# EAGLE design Main_board_rev21_top_image (EAGLE 9.1.1)

## Sheet 1 of 2
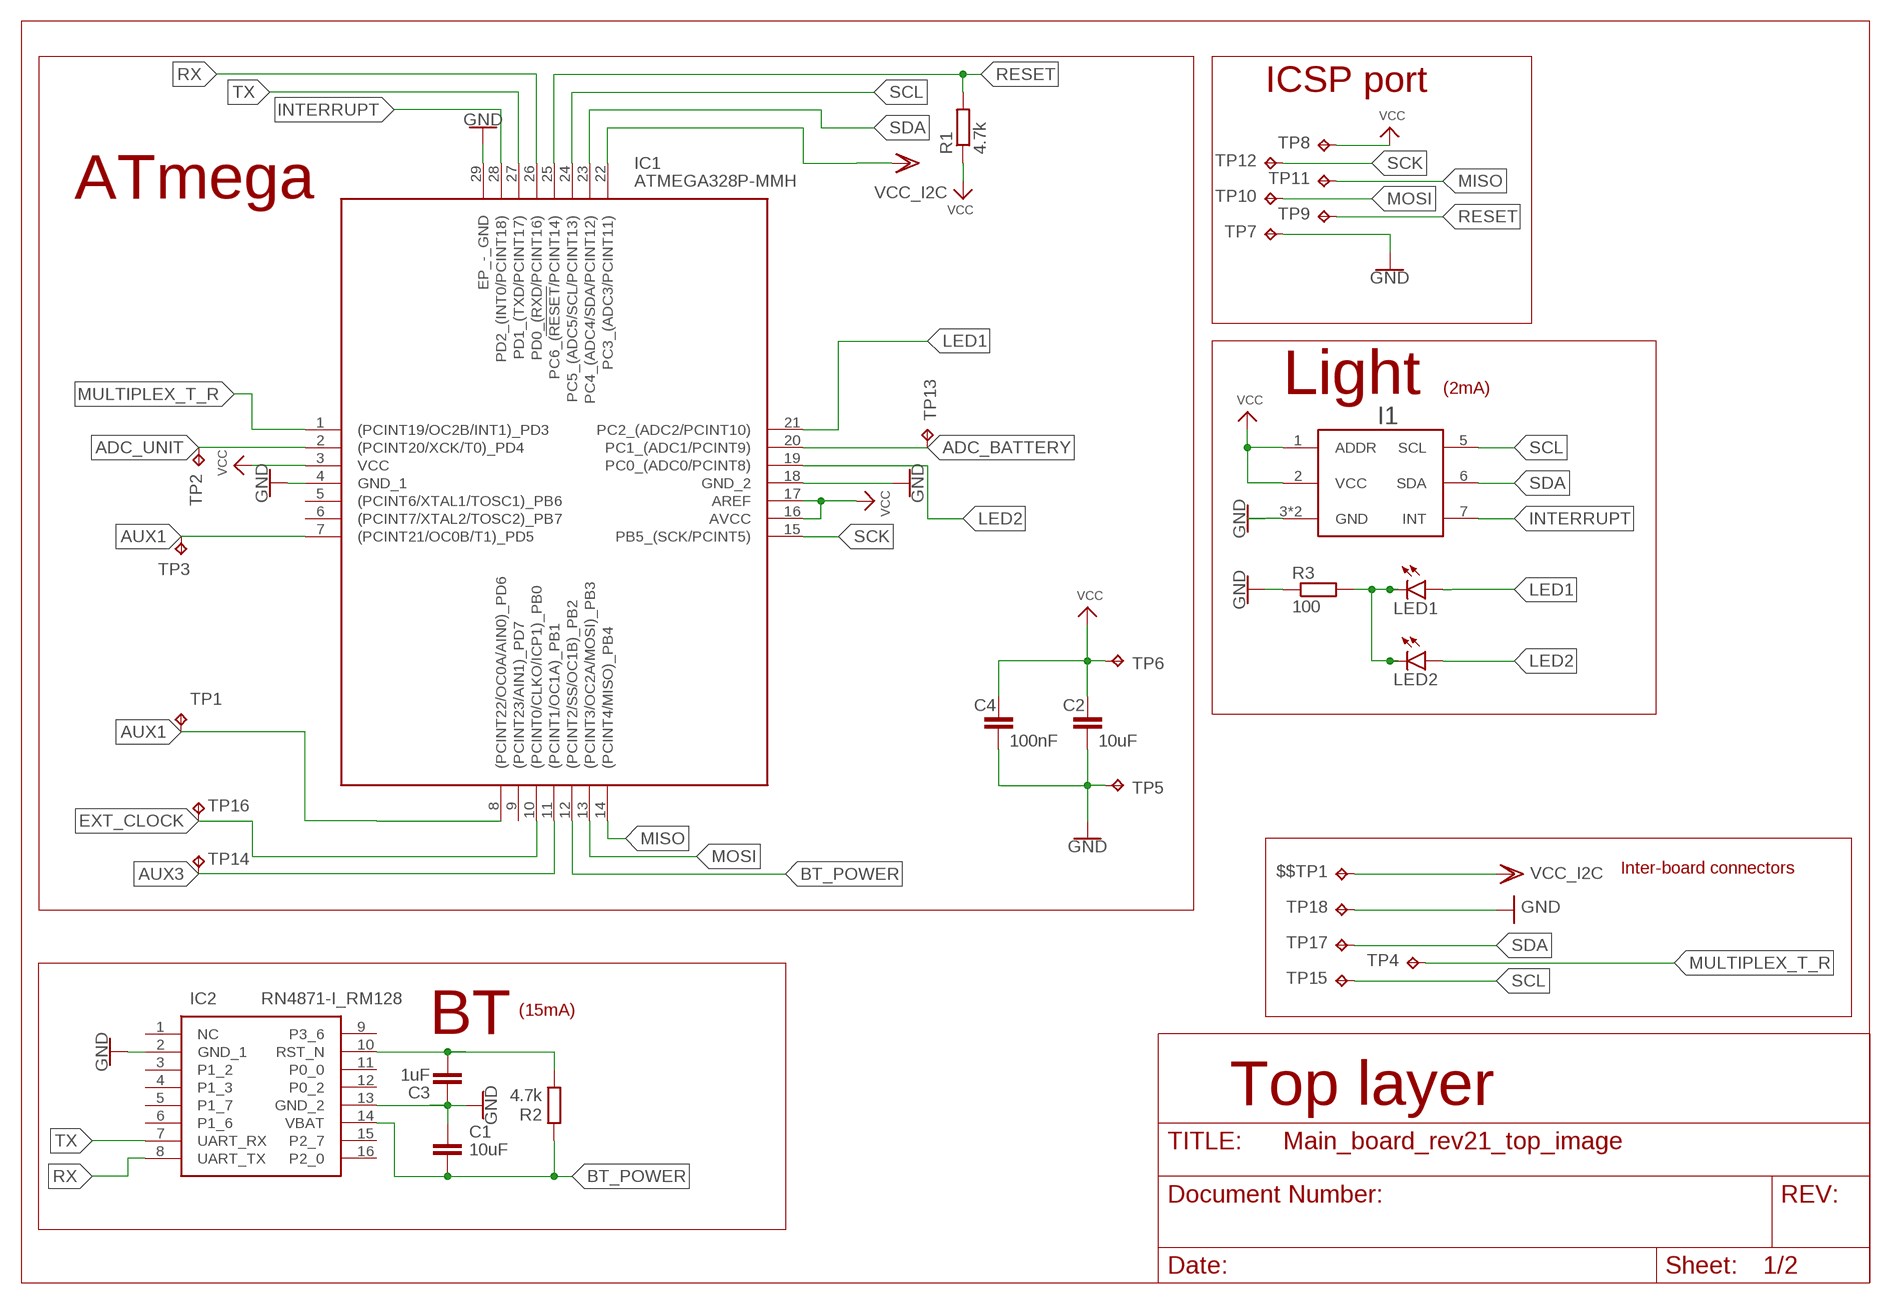
[diagram p0: schematic, sheet 1]

### Parts
$$TP1  TP  [TEST_PAD_1MM]
C1  10uF  C-EUC0603K  [C0603K]
C2  10uF  C-EUC0603K  [C0603K]
C3  1uF  C-EUC0603K  [C0603K]
C4  100nF  C-EUC0603K  [C0603K]
I1  BH1745NUC  [WSON008X2120]
IC1  ATMEGA328P-MMH  [QFN45P400X400X100-29N]
IC2  RN4871-I_RM128  [RN4871]
LED1  LEDCHIPLED_0603  [CHIPLED_0603]
LED2  LEDCHIPLED_0603  [CHIPLED_0603]
R1  4.7k  R-EU_R0603  [R0603]
R2  4.7k  R-EU_R0603  [R0603]
R3  100  R-EU_R0603  [R0603]
TP1  TP  [TEST_PAD_1MM]
TP2  TP  [TEST_PAD_1MM]
TP3  TP  [TEST_PAD_1MM]
TP4  TP  [TEST_PAD_1MM]
TP5  TP  [TEST_PAD_1MM]
TP6  TP  [TEST_PAD_1MM]
TP7  TPTP09SQ  [TP09SQ]
TP8  TPTP09SQ  [TP09SQ]
TP9  TPTP09SQ  [TP09SQ]
TP10  TPTP09SQ  [TP09SQ]
TP11  TPTP09SQ  [TP09SQ]
TP12  TPTP09SQ  [TP09SQ]
TP13  TP  [TEST_PAD_1MM]
TP14  TP  [TEST_PAD_1MM]
TP15  TP  [TEST_PAD_1MM]
TP16  TP  [TEST_PAD_1MM]
TP17  TP  [TEST_PAD_1MM]
TP18  TP  [TEST_PAD_1MM]

### Nets
ADC_BATTERY: IC1.20(PC1_(ADC1/PCINT9)) TP13.P$1(TP)
ADC_UNIT: IC1.2((PCINT20/XCK/T0)_PD4) TP2.P$1(TP)
AUX1: IC1.7((PCINT21/OC0B/T1)_PD5) TP3.P$1(TP)
AUX3: IC1.11((PCINT1/OC1A)_PB1) TP14.P$1(TP)
BT_POWER: C1.1 IC1.12((PCINT2/SS/OC1B)_PB2) IC2.14(VBAT) R2.2
BT_RESET: C3.2 IC2.10(RST_N) R2.1
EXT_CLOCK: IC1.10((PCINT0/CLKO/ICP1)_PB0) TP16.P$1(TP)
GND: C1.2 C2.2 C3.1 C4.2 I1.3(GND) I1.4(GND) IC1.4(GND_1) IC1.18(GND_2) IC1.29(EP_-_GND) IC2.2(GND_1) IC2.13(GND_2) R3.1 TP5.P$1(TP) TP7.TP TP18.P$1(TP)
INTERRUPT: I1.7(INT) IC1.28(PD2_(INT0/PCINT18))
LED1: IC1.21(PC2_(ADC2/PCINT10)) LED1.A
LED2: IC1.19(PC0_(ADC0/PCINT8)) LED2.A
MISO: IC1.14((PCINT4/MISO)_PB4) TP11.TP
MOSI: IC1.13((PCINT3/OC2A/MOSI)_PB3) TP10.TP
MULTIPLEX_T_R: IC1.1((PCINT19/OC2B/INT1)_PD3) TP4.P$1(TP)
N$1: IC1.8((PCINT22/OC0A/AIN0)_PD6) TP1.P$1(TP)
N$3: LED1.C LED2.C R3.2
RESET: IC1.25(PC6_(!RESET!/PCINT14)) R1.2 TP9.TP
RX: IC1.26(PD0_(RXD/PCINT16)) IC2.8(UART_TX)
SCK: IC1.15(PB5_(SCK/PCINT5)) TP12.TP
SCL: I1.5(SCL) IC1.24(PC5_(ADC5/SCL/PCINT13)) TP15.P$1(TP)
SDA: I1.6(SDA) IC1.23(PC4_(ADC4/SDA/PCINT12)) TP17.P$1(TP)
TX: IC1.27(PD1_(TXD/PCINT17)) IC2.7(UART_RX)
VCC: C2.1 C4.1 I1.1(ADDR) I1.2(VCC) IC1.3(VCC) IC1.16(AVCC) IC1.17(AREF) R1.1 TP6.P$1(TP) TP8.TP
VDD: $$TP1.P$1(TP) IC1.22(PC3_(ADC3/PCINT11)) ; supply symbol labelled VCC_I2C
Unconnected: IC1.5((PCINT6/XTAL1/TOSC1)_PB6) IC1.6((PCINT7/XTAL2/TOSC2)_PB7) IC1.9((PCINT23/AIN1)_PD7) IC2.1(NC) IC2.3(P1_2) IC2.4(P1_3) IC2.5(P1_7) IC2.6(P1_6) IC2.9(P3_6) IC2.11(P0_0) IC2.12(P0_2) IC2.15(P2_7) IC2.16(P2_0)

### Notes on the sheet
- ICSP port
- ATmega
- Light | (2mA)
- Inter-board connectors
- (15mA)
- BT
- Top layer

## Sheet 2 of 2

## Library data of the parts
$$TP1 TP1-TP18 = 0_my_lib:TP: Test pad
C1-C4 = resistor:C-EU: CAPACITOR, European symbol
I1 = 0_my_lib:BH1745NUC: A RGBC ambient light sensor
IC1 = SamacSys_Parts:ATMEGA328P-MMH: Atmel ATMEGA328P-MMH, 8bit AVR Microcontroller, 20MHz, 32 kB Flash, 28-Pin QFN Source: Datasheet <https://componentsearchengine.com/Datasheets/1/ATMEGA328P-MMH.pdf>; DESCRIPTION: Atmel ATMEGA328P-MMH, 8bit AVR Microcontroller, 20MHz, 32 kB Flash, 28-Pin QFN; HEIGHT: 1mm; MANUFACTURER_NAME: Microchip; MANUFACTURER_PART_NUMBER: ATMEGA328P-MMH; MOUSER_PART_NUMBER: 556-ATMEGA328P-MMH
IC2 = SamacSys_Parts:RN4871-I_RM128: Bluetooth / 802.15.1 Modules Bluetooth 4.2 BLE Module, ASCII Interface, Shielded, Antenna, 9x11.5mm, Industrial Temp Source: Datasheet <http://www.mouser.com/datasheet/2/268/50002489A-957652.pdf>; DESCRIPTION: Bluetooth / 802.15.1 Modules Bluetooth 4.2 BLE Module, ASCII Interface, Shielded, Antenna, 9x11.5mm, Industrial Temp; HEIGHT: mm; MANUFACTURER_NAME: Microchip; MANUFACTURER_PART_NUMBER: RN4871-I/RM128; MOUSER_PART_NUMBER: 579-RN4871-I/RM128
LED1 LED2 = led:LED: LED OSRAM: - CHIPLED LG R971, LG N971, LY N971, LG Q971, LY Q971, LO R971, LY R971 LH N974, LH R974 LS Q976, LO Q976, LY Q976 LO Q996 - Hyper CHIPLED LW Q18S LB Q993, LB Q99A, LB R99A - SideLED LS A670, LO A670, LY A670, LG A670, LP A670 LB A673, LV A673, LT A673, LW A673 LH A674 LY A675 LS A676, LA A676, LO A676, LY A676, LW A676 LS A679, LY A679, LG A679 - Hyper Micro SIDELED® LS Y876, LA Y876, LO Y876, LY Y876 LT Y87S - SmartLED LW L88C, LW L88S LB L89C, LB L89S, LG L890 LS L89K, LO L89K, LY L89K LS L896, LA L896, LO L896, LY L896 - TOPLED LS T670, LO T670, LY T670, LG T670, LP T670 LSG T670, LSP T670, LSY T670, LOP T670, LYG T670 LG T671, LOG T671, LSG T671 LB T673, LV T673, LT T673, LW T673 LH T674 LS T676, LA T676, LO T676, LY T676, LB T676, LH T676, LSB T676, LW T676 LB T67C, LV T67C, LT T67C, LS T67K, LO T67K, LY T67K, LW E67C LS E67B, LA E67B, LO E67B, LY E67B, LB E67C, LV E67C, LT E67C LW T67C LS T679, LY T679, LG T679 LS T770, LO T770, LY T770, LG T770, LP T770 LB T773, LV T773, LT T773, LW T773 LH T774 LS E675, LA E675, LY E675, LS T675 LS T776, LA T776, LO T776, LY T776, LB T776 LHGB T686 LT T68C, LB T68C - Hyper Mini TOPLED® LB M676 - Mini TOPLED Santana® LG M470 LS M47K, LO M47K, LY M47K Source: http://www.osram.convergy.de LUXEON: - LUMILED® LXK2-PW12-R00, LXK2-PW12-S00, LXK2-PW14-U00, LXK2-PW14-V00 LXK2-PM12-R00, LXK2-PM12-S00, LXK2-PM14-U00 LXK2-PE12-Q00, LXK2-PE12-R00, LXK2-PE12-S00, LXK2-PE14-T00, LXK2-PE14-U00 LXK2-PB12-K00, LXK2-PB12-L00, LXK2-PB12-M00, LXK2-PB14-N00, LXK2-PB14-P00, LXK2-PB14-Q00 LXK2-PR12-L00, LXK2-PR12-M00, LXK2-PR14-Q00, LXK2-PR14-R00 LXK2-PD12-Q00, LXK2-PD12-R00, LXK2-PD12-S00 LXK2-PH12-R00, LXK2-PH12-S00 LXK2-PL12-P00, LXK2-PL12-Q00, LXK2-PL12-R00 Source: www.luxeon.com KINGBRIGHT: KA-3528ASYC Source: www.kingbright.com
R1-R3 = rcl:R-EU_: RESISTOR, European symbol; SPICEPREFIX: R

## Board
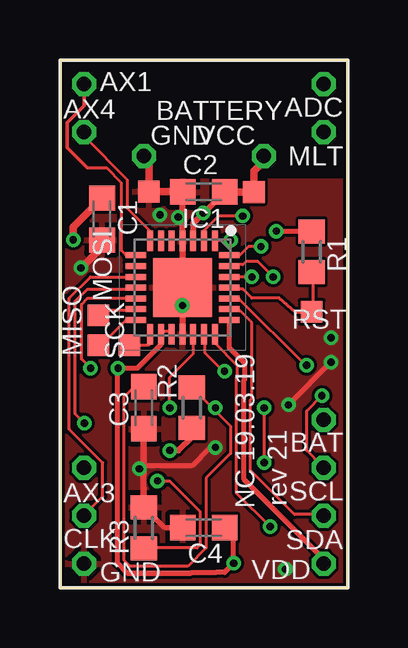
[diagram p1: board, top side]
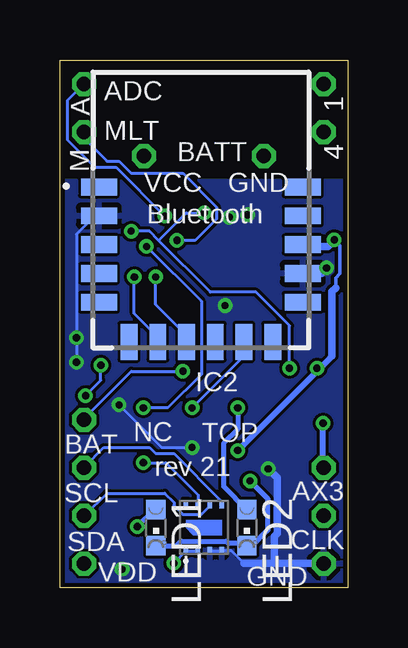
[diagram p2: board, bottom side, seen from below]

Size 12 x 22 mm. Coordinates in mm from the lower left corner, seen from the top.
Outline: 12,22 0,22 0,0 12,0 12,22
Copper layers (1*16): Top 0.035mm / dielectric 0.8mm / Bottom 0.035mm
Design rules "china_jlcpcb_rev2": minimum track width 5mil, minimum drill 0.3mm, track to track 5mil, track to pad 5mil, pad to pad 5mil, via to via 5mil, smd to smd 5mil, copper to edge 0.2mm, drill to drill 5mil, minimum pad ring 6mil, minimum via ring 6mil, stop-mask expansion 0.5mm, vias tented up to drill 0.35mm, thermal gap 8mil
tRestrict: area 2,18 to 10,22
bRestrict: area 2,18 to 10,22

### Footprints (pad centres in the part's own frame; a part is rotated, then mirrored left to right if it is on the bottom)
TEST_PAD_1MM = drill 0.6 pad 1 octagon: P$1 0,0
C0603K = smd 1.05 x 1.08: 1 -0.875,0; 2 0.875,0
WSON008X2120 = smd 0.2 x 0.35: 1 -0.75,-0.975; 2 -0.25,-0.975; 3 0.25,-0.975; 4 0.75,-0.975; 5 0.75,0.975; 6 0.25,0.975; 7 -0.25,0.975; 8 -0.75,0.975
QFN45P400X400X100-29N = smd 0.85 x 0.25: 1 -1.95,1.35; 2 -1.95,0.9; 3 -1.95,0.45; 4 -1.95,0; 5 -1.95,-0.45; 6 -1.95,-0.9; 7 -1.95,-1.35; 15 1.95,-1.35; 16 1.95,-0.9; 17 1.95,-0.45; 18 1.95,0; 19 1.95,0.45; 20 1.95,0.9; 21 1.95,1.35 | smd 0.25 x 0.85: 8 -1.35,-1.95; 9 -0.9,-1.95; 10 -0.45,-1.95; 11 0,-1.95; 12 0.45,-1.95; 13 0.9,-1.95; 14 1.35,-1.95; 22 1.35,1.95; 23 0.9,1.95; 24 0.45,1.95; 25 0,1.95; 26 -0.45,1.95; 27 -0.9,1.95; 28 -1.35,1.95 | smd 2.45 x 2.45: 29 0,0
RN4871 = smd 1.5 x 0.7: 1 -4.25,6.7; 2 -4.25,5.5; 3 -4.25,4.3; 4 -4.25,3.1; 5 -4.25,1.9; 12 4.25,1.9; 13 4.25,3.1; 14 4.25,4.3; 15 4.25,5.5; 16 4.25,6.7 | smd 0.7 x 1.5: 6 -3,0.25; 7 -1.8,0.25; 8 -0.6,0.25; 9 0.6,0.25; 10 1.8,0.25; 11 3,0.25
CHIPLED_0603 = smd 0.8 x 0.8: A 0,-0.75; C 0,0.75
R0603 = smd 1 x 1.1: 1 -0.85,0; 2 0.85,0
TP09SQ = smd 0.9 x 0.9: TP 0,0

### Placement (x,y rotation side)
$$TP1  11,1 0 top
C1  1.75,15.36 270 top
C2  6,16.5 180 top
C3  3.5,7.5 90 top
C4  6,2.5 180 top
I1  6,2.51 0 bottom
IC1  5.11,12.51 270 top
IC2  6.12,10 0 bottom
LED1  8,2.5 180 bottom
LED2  4.2,2.5 180 bottom
R1  10.5,14 270 top
R2  5.5,7.5 270 top
R3  3.5,2.49 270 top
TP1  1,21 0 top
TP2  11,21 0 top
TP3  1,19 0 top
TP4  11,19 0 top
TP5  3.5,18 0 top
TP6  8.5,18 0 top
TP7  3.72,16.51 0 top
TP8  8.09,16.49 0 top
TP9  10.5,11.5 0 top
TP10  1.6,11.35 0 top
TP11  1.6,10.1 0 top
TP12  2.9,10.1 0 top
TP13  11,7 0 top
TP14  1,5 0 top
TP15  11,5 0 top
TP16  1,3 0 top
TP17  11,3 0 top
TP18  1,1 0 top

### Tracks (layer width: path | path; a pad name or v marks a point on that pad's centre or on a via)
ADC_BATTERY  (via drill 0.3)
  Top 0.127: v6.87,9.02 6.82,9.02 6.06,9.78 6.06,10.55 IC1.20
  Bottom 0.127: v6.87,9.02 9.03,9.02 10.93,7.11 TP13.P$1
ADC_UNIT  (via drill 0.3)
  Top 0.127: IC1.2 6,14.89 6.61,15.49 v7.63,15.49
  Bottom 0.127: v7.63,15.49 9.66,17.53 10.55,17.53 11.69,18.67 11.69,20.31 TP2.P$1
AUX1
  Top 0.127: TP3.P$1 1.02,18.98 1.02,18.8 2.8,17.02 2.8,15.82 3.76,14.86 IC1.7
AUX3  (via drill 0.3)
  Top 0.127: v1.02,6.86 0.64,7.24 0.64,11.94 1.15,12.45 3.06,12.45 IC1.11
  Bottom 0.254: TP14.P$1 1.02,5.02 v1.02,6.86
BT_POWER  (via drill 0.3)
  Top 0.127: v1.28,9.14 0.9,9.53 0.9,11.81 1.15,12.06 3.06,12.06 IC1.12
  Top 0.254: R2.2 5.5,6.28 4.94,5.71 v4.58,5.71
  Top 0.305: 1.41,16.24 C1.1 0.55,15.04 v0.55,14.5
  Bottom 0.127: 1.53,14.22 1.79,14.22 IC2.14 | 1.28,9.02 v1.28,9.14 | 1.53,14.22 IC2.14 | 1.53,14.22 IC2.14 | 0.77,9.65 0.71,9.59
  Bottom 0.152: 0.5,12.5 0.5,12.92 0.32,13.09 0.32,14.27 v0.55,14.5
  Bottom 0.254: v4.58,5.71 1.28,9.02 0.71,9.59 0.65,9.65 0.64,9.65
  Bottom 0.305: IC2.14 1.86,14.29 1.46,14.29 | v0.55,14.5 0.83,14.22 1.53,14.22 | 0.65,9.65 0.65,12.35 0.5,12.5
BT_RESET  (via drill 0.3)
  Top 0.127: C3.2 3.1,8.38 2.67,7.95 2.67,1.14 2.93,0.89 5.34,0.89 6.1,1.65 6.1,4.57 7.12,5.59 7.12,6.73 6.36,7.49 | 6.36,7.49 5.6,8.26 R2.1 | 6.36,7.49 v6.49,7.49
  Bottom 0.127: v6.49,7.49 4.33,9.65 4.33,10.16 IC2.10
EXT_CLOCK
  Top 0.127: IC1.10 3.06,12.95 1.28,12.95 0.39,12.06 0.39,6.6 1.79,5.21 1.79,3.81 1.02,3.05 TP16.P$1
GND  (via drill 0.3)
  Top 0.127: 3.68,3.18 3.56,3.3 R3.1 3.44,3.43 3.44,4.95 | 3.44,4.95 3.44,5.08 | 3.44,5.08 3.44,6.6 C3.1 | 3.44,4.95 v3.31,4.95 3.44,5.08 | 5.21,12.45 IC1.29 5.21,12.57 | TP7.TP 5,16.51 5.09,16.51 C2.2 5.21,16.38 | 5.5,5.08 3.44,5.08
  Top 0.203: C4.2 4.37,2.5 3.68,3.18 | C3.1 3.5,4.7 3.49,4.69 3.49,4.2 3.5,4.19 R3.1 | v6.49,5.84 6.26,5.84 5.5,5.08 3.56,5.08 3.44,4.95 | v11.31,9.4 v9.53,7.62
  Top 0.254: 5,16.51 5.11,16.4 IC1.4 IC1.18
  Top 0.305: 5.21,16.38 5.09,16.51 TP7.TP 3.72,17.78 TP5.P$1 | v0.88,13.32 1.75,14.2 C1.2
  Bottom 0.127: I1.3 5.72,1.52 5.34,1.52 I1.4 5.21,1.52 4.83,1.52 4.33,1.02 3.06,1.02 1.02,1.02 TP18.P$1 | v6.49,5.84 7.76,5.84 v9.53,7.62 | v11.31,9.4 v11.31,10.41 11.31,14.73 10.42,15.62 IC2.2
  Bottom 0.305: 3.06,1.02 3.06,2.13 2.93,2.25 2.93,4.57 v3.31,4.95 | TP18.P$1 1.02,1.02 4.33,1.02 | IC2.13 1.1,13.1 v0.88,13.32
  other vias: 9.41,0.76 5.11,11.76 4.17,15.54 4.94,15.44
  pour Top: 12,17 0,17 0,0 12,0
  pour Bottom: 12,17 0,17 0,0 12,0
INTERRUPT  (via drill 0.3)
  Top 0.127: v8.52,7.49 v8.52,5.21 | v8.39,14.22 7.87,14.22 7.51,13.86 IC1.28
  Bottom 0.127: 6.25,3.88 7.58,5.21 v8.52,5.21 | v8.52,7.49 7.5,7.49 6.1,8.89 6.1,11.94 v8.39,14.22 | 6.25,3.88 | 6.25,3.88 I1.7
LED1  (via drill 0.3)
  Top 0.127: v8.77,2.54 7.37,3.94 7.37,8.76 7.41,8.79 7.41,9.24 6.49,10.17 6.49,10.53 IC1.21
  Bottom 0.127: 8.65,2.65 v8.77,2.54
  Bottom 0.2: LED1.A 8.06,3.25 v8.77,2.54
  Bottom 0.203: 8.61,2.65 8.65,2.65
LED2  (via drill 0.3)
  Top 0.127: v4.58,7.49 4.58,8.76 5.57,9.75 5.57,10.49 5.56,10.54 IC1.19
  Bottom 0.2: LED2.A 5.16,4.21 5.16,4.43
  Bottom 0.203: 5.16,4.43 5.16,6.02 4.58,6.6 v4.58,7.49
MISO
  Top 0.127: TP11.TP 1.65,10.05 2.75,11.15 2.74,11.16 IC1.14
MOSI
  Top 0.127: TP10.TP 1.72,11.56 3.06,11.56 IC1.13
MULTIPLEX_T_R  (via drill 0.3)
  Top 0.127: v7.12,14.48 6.49,14.48 IC1.1
  Bottom 0.127: v7.12,14.48 6.36,14.48 5.47,15.37 5.47,15.88 6.87,17.27 9.03,17.27 9.53,17.78 10.04,17.78 10.93,18.67 10.93,18.93 TP4.P$1
N$1
  Top 0.127: 1.13,17.5 1.94,17.5 2.55,16.89 2.55,14.06 2.75,13.86 IC1.8
  Top 0.152: TP1.P$1 1,20.1 0.3,19.39 0.3,18.34 1.13,17.5
N$3  (via drill 0.3)
  Top 0.127: v4.07,4.45 4.58,4.45 5.85,3.17 5.85,1.78 5.72,1.65 3.56,1.65 R3.2
  Bottom 0.127: 3.95,1.78 3.86,1.86
  Bottom 0.152: LED2.C 4,1.75 3.97,1.75 3.95,1.78
  Bottom 0.2: LED1.C 7.99,1.74 7.14,1.74 | 3.37,2.36 3.39,2.36 4,1.75
  Bottom 0.203: 7.14,1.74 6.95,1.94 5.05,1.94 4.98,1.86 3.86,1.86 | 3.37,2.36 3.36,2.36 3.32,2.4 3.32,3.69 v4.07,4.45
RESET
  Top 0.127: R1.2 10.55,13.08 10.55,11.56 TP9.TP 9.83,11.5 9.15,12.06 8.01,12.06 7.63,12.45 7.12,12.45 IC1.25
RX  (via drill 0.3)
  Top 0.127: v8.01,12.95 7.12,12.95 IC1.26
  Bottom 0.127: v8.01,12.95 8.01,11.81 6.74,10.54 6.74,10.29 IC2.8
SCK
  Top 0.127: IC1.15 3.76,10.16 3.65,10.1 TP12.TP
SCL  (via drill 0.3)
  Top 0.127: v10.29,9.27 10.24,9.27 7.48,12.04 7.07,12.04 IC1.24 | v10.93,8 10.29,7.37 10.29,5.71 10.93,5.08 TP15.P$1
  Bottom 0.127: 5.25,3.59 7.25,5.59 8.01,5.59 8.26,5.84 10.17,5.84 10.93,5.08 TP15.P$1 | I1.5 | v10.29,9.27 10.29,8.64 v10.93,8
  Bottom 0.15: I1.5 5.25,3.59
SDA
  Top 0.127: TP17.P$1 10.95,3.05 9.79,3.05 7.96,4.88 7.96,7.82 8.01,7.87 8.01,11.05 7.5,11.56 7.11,11.56 IC1.23
  Bottom 0.127: I1.6 5.72,3.43 6.1,3.05 6.87,3.05 7.25,3.43 7.25,3.56 7.63,3.94 10.04,3.94 10.93,3.05 TP17.P$1
TX  (via drill 0.3)
  Top 0.127: v8.9,12.95 8.26,13.59 7.76,13.59 7.63,13.46 7.12,13.46 IC1.27
  Bottom 0.127: v8.9,12.95 8.9,11.43 8.01,10.54 8.01,10.29 IC2.7
VCC  (via drill 0.3)
  Top 0.127: IC1.17 4.58,10.67 4.33,10.67 IC1.16 4.2,10.55 4.2,10.16 3.18,9.14 2.93,9.14 | 7.25,2.16 6.99,2.41 C4.1 | 2.42,8.64 2.42,1.02 2.8,0.64 6.5,0.64 | v5.98,15.62 v5.99,15.61
  Top 0.203: R1.1 v9.03,14.85 v9.03,14.86 | 7.25,2.16 v7.25,1.02 6.87,0.64 6.5,0.64 5.5,0.64 5.46,0.6 2.81,0.6 2.38,1.02 2.38,9.11 v2.42,9.14 3.22,9.14 4.22,10.14 IC1.16
  Top 0.254: C2.1 v5.99,15.61 5.56,15.19 IC1.3
  Top 0.305: C2.1 TP8.TP 8.1,17.37 8.5,17.77 TP6.P$1
  Bottom 0.127: I1.1 6.23,1.52 I1.2 | I1.1 | v7.25,1.02 I1.1 | v9.03,14.86 8.26,14.86 7.88,14.48 | 7.88,14.48 5.72,12.32 3.82,12.32 2.42,10.92 v2.42,9.14 | v5.98,15.62 6.74,15.62 7.88,14.48
VDD
  Top 0.127: 10.93,1.27 10.93,1.07 $$TP1.P$1
  Top 0.203: 10.93,1.27 7.67,4.53 7.67,8.63 7.7,8.67 7.7,9.36 7.06,10 IC1.22

### Text on the board
tNames: AX1 | AX4 | BATTERY | ADC | VCC | GND | MLT | MOSI | RST | MISO | SCK | BAT | AX3 | SCL | NC 19.03.19 | rev 21 | CLK | SDA | VDD | GND
bNames: 1 | ADC | A | MLT | 4 | BATT | M | GND | VCC | Bluetooth | TOP | NC | BAT | rev 21 | AX3 | SCL | CLK | SDA | GND | VDD